# Altium project MAIN_BOARD.PrjPcb (part 3 of 3)

## Sheet NVME.SchDoc
size B; SheetNumber: 9; SheetTotal: 10
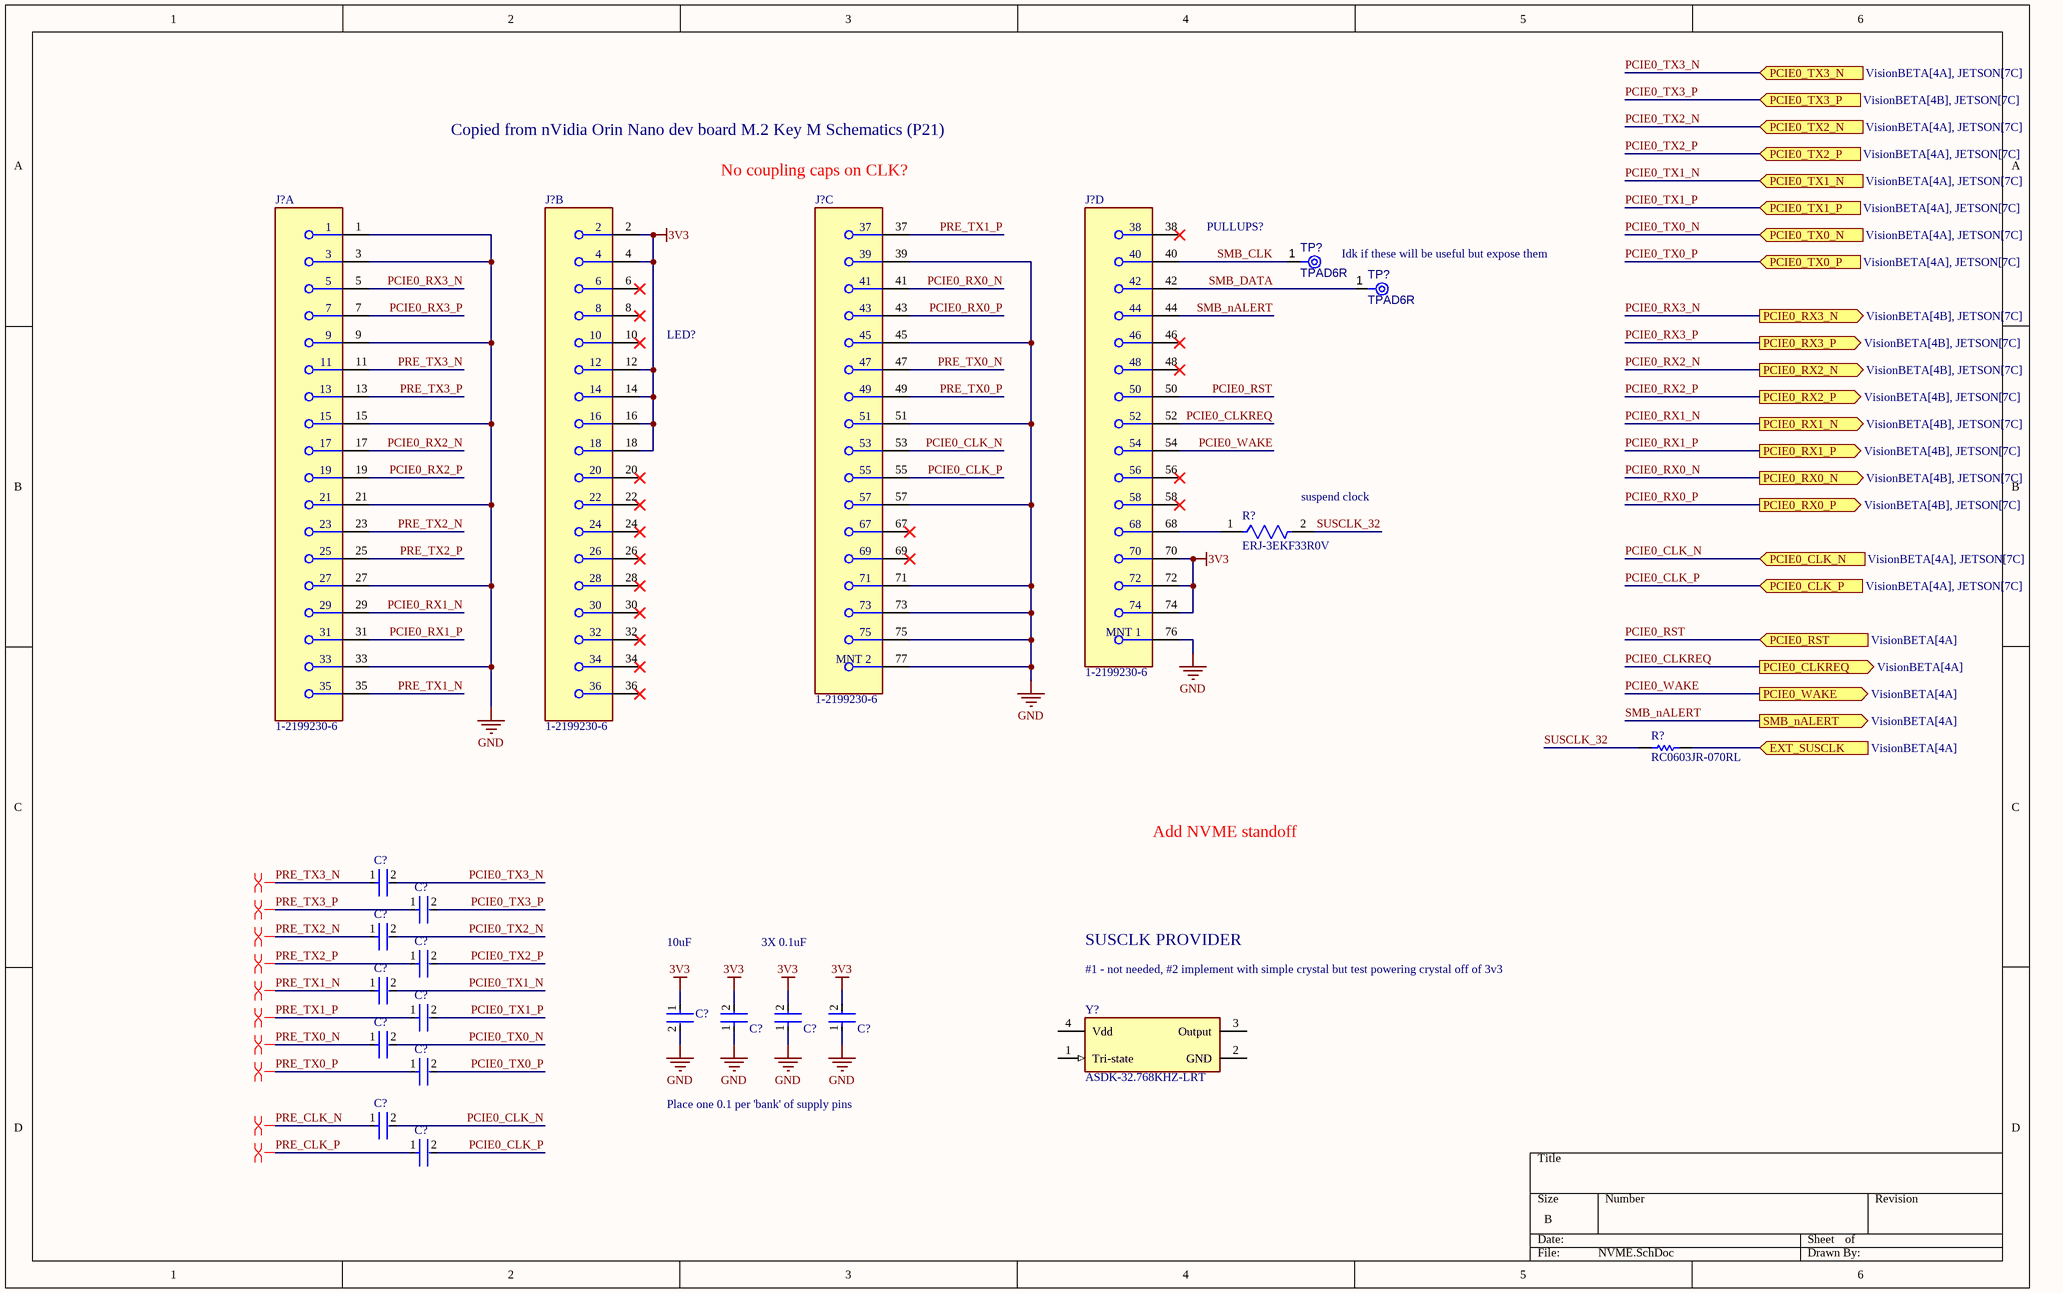
[diagram p12: NVME.SchDoc]

### Parts
(Parts that share a designator on the sheet are numbered #1, #2 ... from top to bottom, then left to right.)
C?#27  C1005X7R1A224K050BB  [FP-C1005-050-0_05-IPC_C]  (value not drawn)
C?#28  C1005X7R1A224K050BB  [FP-C1005-050-0_05-IPC_C]  (value not drawn)
C?#29  C1005X7R1A224K050BB  [FP-C1005-050-0_05-IPC_C]  (value not drawn)
C?#30  C1005X7R1A224K050BB  [FP-C1005-050-0_05-IPC_C]  (value not drawn)
C?#31  C1005X7R1A224K050BB  [FP-C1005-050-0_05-IPC_C]  (value not drawn)
C?#32  GRM188R60J106ME47D  [FP-GRM188-0_1-e0_2_0_55-IPC_A]  (value not drawn)
C?#33  C1005X7R1A224K050BB  [FP-C1005-050-0_05-IPC_C]  (value not drawn)
C?#34  C1005X7R1H104K050BB  [FP-C1005-050-0_05-IPC_C]  (value not drawn)
C?#35  C1005X7R1H104K050BB  [FP-C1005-050-0_05-IPC_C]  (value not drawn)
C?#36  C1005X7R1H104K050BB  [FP-C1005-050-0_05-IPC_C]  (value not drawn)
C?#37  C1005X7R1A224K050BB  [FP-C1005-050-0_05-IPC_C]  (value not drawn)
C?#38  C1005X7R1A224K050BB  [FP-C1005-050-0_05-IPC_C]  (value not drawn)
C?#39  C1005X7R1A224K050BB  [FP-C1005-050-0_05-IPC_C]  (value not drawn)
C?#40  C1005X7R1A224K050BB  [FP-C1005-050-0_05-IPC_C]  (value not drawn)
J?#11  1-2199230-6  [FP-1-2199230-6-MFG]  (part A of 4)
J?#12  1-2199230-6  [FP-1-2199230-6-MFG]  (part B of 4)
J?#13  1-2199230-6  [FP-1-2199230-6-MFG]  (part C of 4)
J?#14  1-2199230-6  [FP-1-2199230-6-MFG]  (part D of 4)
R?#39  ERJ-3EKF33R0V  [FP-ERJ3EK-MFG]
R?#40  RC0603JR-070RL  [RESC1608X55X25ML10T15]
TP?#1  TPAD6R  [TP06R]  (no BOM)
TP?#2  TPAD6R  [TP06R]  (no BOM)
Y?  ASDK-32.768KHZ-LRT  [FP-ASDK-MFG]

### Ports
EXT_SUSCLK (in, see VisionBETA[4A]), PCIE0_CLK_N (in, see VisionBETA[4A], JETSON[7C]), PCIE0_CLK_P (in, see VisionBETA[4A], JETSON[7C]), PCIE0_CLKREQ (out, see VisionBETA[4A]), PCIE0_RST (in, see VisionBETA[4A]), PCIE0_RX0_N (out, see VisionBETA[4B], JETSON[7C]), PCIE0_RX0_P (out, see VisionBETA[4B], JETSON[7C]), PCIE0_RX1_N (out, see VisionBETA[4B], JETSON[7C]), PCIE0_RX1_P (out, see VisionBETA[4B], JETSON[7C]), PCIE0_RX2_N (out, see VisionBETA[4B], JETSON[7C]), PCIE0_RX2_P (out, see VisionBETA[4B], JETSON[7C]), PCIE0_RX3_N (out, see VisionBETA[4B], JETSON[7C]), PCIE0_RX3_P (out, see VisionBETA[4B], JETSON[7C]), PCIE0_TX0_N (in, see VisionBETA[4A], JETSON[7C]), PCIE0_TX0_P (in, see VisionBETA[4A], JETSON[7C]), PCIE0_TX1_N (in, see VisionBETA[4A], JETSON[7C]), PCIE0_TX1_P (in, see VisionBETA[4A], JETSON[7C]), PCIE0_TX2_N (in, see VisionBETA[4A], JETSON[7C]), PCIE0_TX2_P (in, see VisionBETA[4A], JETSON[7C]), PCIE0_TX3_N (in, see VisionBETA[4A], JETSON[7C]), PCIE0_TX3_P (in, see VisionBETA[4B], JETSON[7C]), PCIE0_WAKE (out, see VisionBETA[4A]), SMB_nALERT (out, see VisionBETA[4A])

### Nets
3V3: C?#32.1 C?#34.2 C?#35.2 C?#36.2 J?#12.2 J?#12.4 J?#12.12 J?#12.14 J?#12.16 J?#12.18 J?#14.70 J?#14.72 J?#14.74
GND: C?#32.2 C?#34.1 C?#35.1 C?#36.1 J?#11.1 J?#11.3 J?#11.9 J?#11.15 J?#11.21 J?#11.27 J?#11.33 J?#13.39 J?#13.45 J?#13.51 J?#13.57 J?#13.71 J?#13.73 J?#13.75 J?#13.77(MNT_2) J?#14.76(MNT_1)
PCIE0_CLK_N: C?#39.2 J?#13.53 ; port PCIE0_CLK_N
PCIE0_CLK_P: C?#40.2 J?#13.55 ; port PCIE0_CLK_P
PCIE0_CLKREQ: J?#14.52 ; port PCIE0_CLKREQ
PCIE0_RST: J?#14.50 ; port PCIE0_RST
PCIE0_RX0_N: J?#13.41 ; port PCIE0_RX0_N
PCIE0_RX0_P: J?#13.43 ; port PCIE0_RX0_P
PCIE0_RX1_N: J?#11.29 ; port PCIE0_RX1_N
PCIE0_RX1_P: J?#11.31 ; port PCIE0_RX1_P
PCIE0_RX2_N: J?#11.17 ; port PCIE0_RX2_N
PCIE0_RX2_P: J?#11.19 ; port PCIE0_RX2_P
PCIE0_RX3_N: J?#11.5 ; port PCIE0_RX3_N
PCIE0_RX3_P: J?#11.7 ; port PCIE0_RX3_P
PCIE0_TX0_N: C?#37.2 ; port PCIE0_TX0_N
PCIE0_TX0_P: C?#38.2 ; port PCIE0_TX0_P
PCIE0_TX1_N: C?#31.2 ; port PCIE0_TX1_N
PCIE0_TX1_P: C?#33.2 ; port PCIE0_TX1_P
PCIE0_TX2_N: C?#29.2 ; port PCIE0_TX2_N
PCIE0_TX2_P: C?#30.2 ; port PCIE0_TX2_P
PCIE0_TX3_N: C?#27.2 ; port PCIE0_TX3_N
PCIE0_TX3_P: C?#28.2 ; port PCIE0_TX3_P
PCIE0_WAKE: J?#14.54 ; port PCIE0_WAKE
PRE_CLK_N: C?#39.1
PRE_CLK_P: C?#40.1
PRE_TX0_N: C?#37.1 J?#13.47
PRE_TX0_P: C?#38.1 J?#13.49
PRE_TX1_N: C?#31.1 J?#11.35
PRE_TX1_P: C?#33.1 J?#13.37
PRE_TX2_N: C?#29.1 J?#11.23
PRE_TX2_P: C?#30.1 J?#11.25
PRE_TX3_N: C?#27.1 J?#11.11
PRE_TX3_P: C?#28.1 J?#11.13
SMB_CLK: J?#14.40 TP?#1.1(TP)
SMB_DATA: J?#14.42 TP?#2.1(TP)
SMB_nALERT: J?#14.44 ; port SMB_nALERT
SUSCLK_32: R?#39.2 R?#40.1
NetJ?#14_68: J?#14.68 R?#39.1
NetR?#40_2: R?#40.2 ; port EXT_SUSCLK

Not connected (* = marked no-connect by the designer): J?#12 6* 8* 10* 20* 22* 24* 26* 28* 30* 32* 34* 36*; J?#13 67* 69*; J?#14 38* 46* 48* 56* 58*; Y? 1(Tri-state) 2(GND) 3(Output) 4(Vdd)

### Layout directives
differential pair: PRE_CLK_N, PRE_CLK_P, PRE_TX0_N, PRE_TX0_P, PRE_TX1_N, PRE_TX1_P, PRE_TX2_N, PRE_TX2_P, PRE_TX3_N, PRE_TX3_P

### Notes on the sheet
- Copied from nVidia Orin Nano dev board M.2 Key M Schematics (P21)
- No coupling caps on CLK?
- PULLUPS?
- (near TP?#2) Idk if these will be useful but expose them
- LED?
- (near R?#39) suspend clock
- Add NVME standoff
- 10uF
- 3X 0.1uF
- SUSCLK PROVIDER
- #1 - not needed, #2 implement with simple crystal but test powering crystal off of 3v3
- Place one 0.1 per 'bank' of supply pins

### Library data of the parts
C?#27-C?#31 C?#33 C?#37-C?#40 = CMP-08246-006072-1: Multilayer Ceramic Capacitors 220nF ±10% 10V X7R SMD 0402; Resistor Type: Ceramic; Dielectric: X7R; Voltage Rating (DC): 10V; Width: 0.02inch; Case Code (Metric): 1005; Mount: Surface Mount; Termination: SMD/SMT; Series: C; Tolerance: 10%; Depth: 0.5mm; Length: 1mm; Packaging: Tape and Reel; Radiation Hardening: No; Weight: 2.3E-05oz; Voltage Rating: 10V; Thickness: 0.022inch; Capacitance: 220nF; Case Code (Imperial): 0402; Lead Free: Lead Free; Case/Package: 0402; Package Quantity: 10000; Dielectric Material: Ceramic; RoHS Compliant: Yes; REACH SVHC: No SVHC; Min Operating Temperature: -55°C; Max Operating Temperature: 125°C; Height: 0.5mm; Construction: Flat
C?#32 = CMP-2006-02792-2: Chip Multilayer Ceramic Capacitors for General Purpose, 0603, 10uF, X5R, 15%, 20%, 6.3V; Packaging: Tape and Reel; Voltage Rating (DC): 6.3V; Width: 0.031inch; Termination: SMD/SMT; Dielectric: X5R; Package Quantity: 4000; Voltage Rating: 6.3V; Capacitance: 10uF; Case/Package: 0603; Min Operating Temperature: -55°C; Voltage: 6.3V; Length: 1.6mm; Thickness: 0.035inch; Lead Free: Lead Free; Depth: 0.8mm; Case Code (Imperial): 0603; Max Operating Temperature: 85°C; Material: Ceramic; Height: 0.8mm; Tolerance: 20%; Mount: Surface Mount; REACH SVHC: No SVHC; Radiation Hardening: No; Case Code (Metric): 1608
C?#34-C?#36 = CMP-2000-05393-2: Multilayer Ceramic Capacitors 100nF ±10% 50V X7R SMD 0402; Voltage: 50V; Dielectric Material: Ceramic; Min Operating Temperature: -55°C; Depth: 0.5mm; Radiation Hardening: No; RoHS Compliant: Yes; Voltage Rating (DC): 50V; Lead Free: Lead Free; Resistor Type: Ceramic; Height: 0.5mm; Dielectric: X7R; Thickness: 0.022inch; Case/Package: 0402; Case Code (Metric): 1005; Termination: SMD/SMT; Capacitance: 100nF; Packaging: Tape and Reel; Max Operating Temperature: 125°C; Mount: Surface Mount; Package Quantity: 1; Width: 0.02inch; Weight: 2.3E-05oz; Voltage Rating: 50V; Tolerance: 10%; Construction: Flat; Case Code (Imperial): 0402; Length: 1mm; REACH SVHC: No SVHC; Series: C
J?#11-J?#14 = CMP-03365-000001-1: CONN EDGE DUAL FMALE 67POS 0.020; Manufacturer: TE; Number Of Contacts: 67; Current Rating: 0.5A; Pitch: 0.5mm; Conn Gender: Female; Is Female: yes; Voltage Rating: 50V; Conn Orientation: Right Angle; Automotive: No; Temperature Range High: +80°C; Package: 1-2199230-6; Category: Conn; Temperature: -40°C to +80°C; Number Of Rows: 2; ComponentLink2URL: http://www.te.com/commerce/DocumentDelivery/DDEController?Action=showdoc&DocId=Specification+Or+Standard%7F114-115006%7FB%7Fpdf%7FEnglish%7FENG_SS_114-115006_B_114-115006_REV_B.pdf%7F1-2199230-6; Manufacturer Part Number: 1-2199230-6; Height: 4.2mm; RoHS: TRUE; Footprint Url: http://www.te.com/commerce/DocumentDelivery/DDEController?Action=showdoc&DocId=Customer+Drawing%7F2199230%7FB2%7Fpdf%7FEnglish%7FENG_CD_2199230_B2.pdf%7F1-2199230-6; Digikey Description: CONN EDGE DUAL FMALE 67POS 0.020; Device Class L2: Card Edge Connectors; Contact Material: Gold,Tin; Device Class L1: Connectors; Device Class L3: unset; ComponentLink2Description: Datasheet; Temperature Range Low: -40°C; Octopart: https://octopart.com/1-2199230-6-te+connectivity-34969376; Lead Free: Yes
R?#39 = CMP-2000-00443-2: RES SMD 33 OHM 1% 1/10W 0603; Voltage Rating (DC): 75V; Power Rating: 100mW; Resistance: 33R; Temperature Coefficient: 100ppm/°C; Min Operating Temperature: -55°C; Packaging: Tape and Reel; Mount: Surface Mount; Lead Free: Lead Free; Voltage Rating: 75V; Features: Automotive AEC-Q200; Height: 0.022inch; Width: 0.031inch; Number of Pins: 2; Package Quantity: 1; Case Code (Metric): 1608; Max Power Dissipation: 100mW; Case Code (Imperial): 0603; Termination: SMD/SMT; Resistance Tolerance: 1%; Max Operating Temperature: 155°C; Tolerance: 1%; Length: 1.6mm; Case/Package: 0603; Military Standard: Not; RoHS Compliant: Yes; Series: ERJ; Size Code: 0603; Construction: Rectangular; Number of Terminations: 2; Radiation Hardening: No; Resistor Type: Thick Film; Contact Plating: Tin; Depth: 0.8mm; REACH SVHC: No SVHC
R?#40 = CMP-2100-03667-1: Chip Resistor, 0 Ohm, +/- 5%, 0.1 W, -55 to 155 degC, 0603 (1608 Metric), RoHS, Tape and Reel; Manufacturer: Yageo; Temperature Coefficient: 200ppm/degreesC; Voltage Rating: 50V; Power Rating: 100mW; Resistance: 0mOhm; Width: 0.8mm; Max Operating Temperature: 155degC; Tolerance: 5%; Package Reference: 0603; Height: 0.45mm; Depth: 0.8mm; Package Description: 2-Pin Surface Mount Device, Body 1.6 x 0.8 mm; Termination: SMD/SMT; Package Quantity: 5000; Case/Package: 0603; Case Code (Imperial): 0603; Radiation Hardening: No; Number of Pins: 2; Length: 1.6mm; Lead Free: LeadFree; Voltage Rating (DC): 50V; Military Standard: Not; Datasheet URL: http://www.yageo.com/NewPortal/yageodocoutput?fileName=/pdf/R-Chip/PYu-RC_Group_51_RoHS_L_5.pdf; Manufacturer URL: http://www.yageo.com/; Packaging: TapeandReel; Case Code (Metric): 1608; Min Operating Temperature: -55degC; Composition: ThickFilm; RoHSCompliant: true; Contact Plating: Tin; Datasheet Version: Rev. 5, 10/2016; REACH SVHC: NoSVHC
TP?#1 TP?#2 = CMP-00028-00002-2: 0.6mm round; Pins: 1
Y? = CMP-27762-001115-1: XTAL OSC XO 32.7680KHZ CMOS SMD; Load Capacitance: 15pF; Max Supply Current: 3.5mA; Min Supply Voltage: 2.97V; Operating Supply Voltage: 3.3V; Frequency Stability: 25ppm; Lead Free: Lead Free; Case/Package: CSMD; Number of Pins: 4; Max Operating Temperature: 85°C; Packaging: Tape and Reel; Width: 0.079inch; Min Operating Temperature: -40°C; Radiation Hardening: No; Length: 2.5mm; Depth: 2mm; Termination: SMD/SMT; Height: 0.037inch; Series: ASDK; Frequency: 32.768kHz; Mount: Surface Mount

## Sheet RECOVERY_USBC.SchDoc
size A4; SheetNumber: 8; SheetTotal: 8
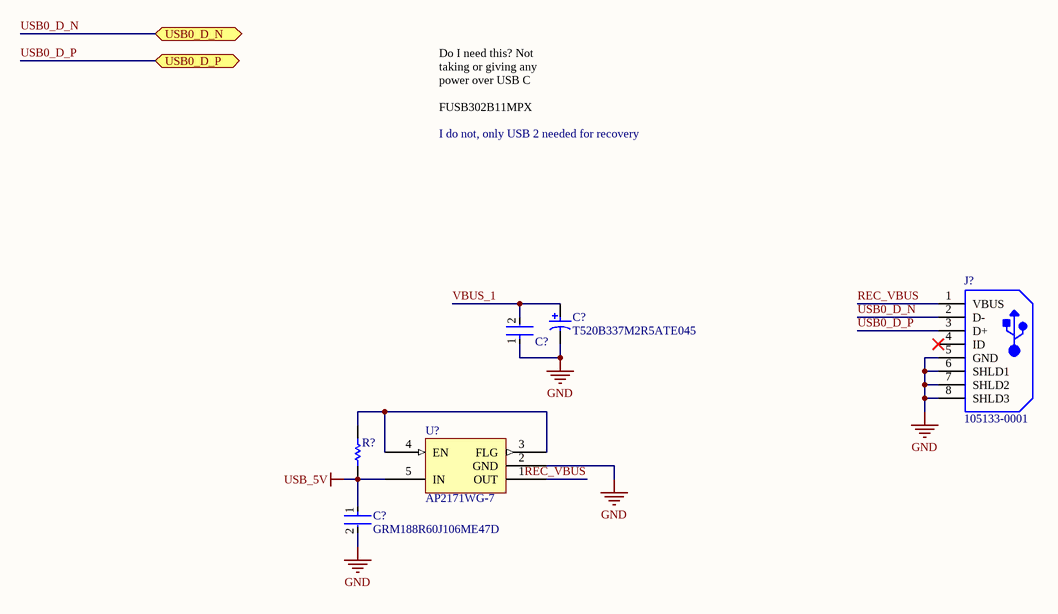
[diagram p13: RECOVERY_USBC.SchDoc]

### Parts
(Parts that share a designator on the sheet are numbered #1, #2 ... from top to bottom, then left to right.)
C?#41  T520B337M2R5ATE045  [KEMT-520-B-2_M]
C?#42  C1005X7R1H104K050BB  [FP-C1005-050-0_05-IPC_C]  (value not drawn)
C?#43  GRM188R60J106ME47D  [FP-GRM188-0_1-e0_2_0_55-IPC_A]
J?#15  105133-0001  [MOLX-105133-0001_V]
R?#41  ERJ3EKF1002V  [RESC1609X55X30LL15T15]  (value not drawn)
U?#4  AP2171WG-7  [SOT95P285X130-5N]

### Ports
USB0_D_N (bidir), USB0_D_P (bidir)

### Nets
GND: C?#41.2 C?#42.1 C?#43.2 J?#15.5(GND) J?#15.6(SHLD1) J?#15.7(SHLD2) J?#15.8(SHLD3) U?#4.2(GND)
USB_5V: C?#43.1 R?#41.1 U?#4.5(IN)
REC_VBUS: J?#15.1(VBUS) U?#4.1(OUT)
USB0_D_N: J?#15.2(D-) ; port USB0_D_N
USB0_D_P: J?#15.3(D+) ; port USB0_D_P
VBUS_1: C?#41.1 C?#42.2
NetR?#41_2: R?#41.2 U?#4.3(FLG) U?#4.4(EN)

Not connected (* = marked no-connect by the designer): J?#15 4(ID)*

### Notes on the sheet
- Do I need this? Not taking or giving any power over USB C
  FUSB302B11MPX
- I do not, only USB 2 needed for recovery

### Library data of the parts
C?#41 = CMP-1664-00002-2: Tantalum Capacitor, 330 uF, +/- 20%, 2.5 V, -55 to 105 degC, 2-Pin Molded, RoHS, Tape and Reel; Capacitance: 330 uF; PartNumber: T520B337M2R5ATE045; DatasheetVersion: 07/2016; Radiation Hardening: No; ComponentLink2Description: Datasheet; PackageDescription: 2-Pin Surface Mount Device, Body 3.5 x 2.8 mm; Width: 2.8 mm; ComponentLink2URL: http://capacitoredge.kemet.com/capedge2/DataSheet?pn=T520B337M2R5ATE045; Case/Package: 1411; Length: 3.5 mm; Package Quantity: 2000; Max Operating Temperature: 105 degC; Mounting Technology: Surface Mount; Height: 2.1 mm; RoHSCompliant: True; ComponentLink1URL: http://www.kemet.com/; Mount: Surface Mount; Packaging: Tape and Reel; ComponentLink1Description: Manufacturer URL; Min Operating Temperature: -55 degC
C?#42 = CMP-2000-05393-2: as C?#34 on sheet NVME; Voltage: 50V; Dielectric Material: Ceramic; Min Operating Temperature: -55°C; Depth: 0.5mm; Radiation Hardening: No; RoHS Compliant: Yes; Voltage Rating (DC): 50V; Lead Free: Lead Free; Resistor Type: Ceramic; Height: 0.5mm; Dielectric: X7R; Thickness: 0.022inch; Case/Package: 0402; Case Code (Metric): 1005; Termination: SMD/SMT; Capacitance: 100nF; Packaging: Tape and Reel; Max Operating Temperature: 125°C; Mount: Surface Mount; Package Quantity: 1; Width: 0.02inch; Weight: 2.3E-05oz; Voltage Rating: 50V; Tolerance: 10%; Construction: Flat; Case Code (Imperial): 0402; Length: 1mm; REACH SVHC: No SVHC; Series: C
C?#43 = CMP-2006-02792-2: as C?#32 on sheet NVME; Packaging: Tape and Reel; Voltage Rating (DC): 6.3V; Width: 0.031inch; Termination: SMD/SMT; Dielectric: X5R; Package Quantity: 4000; Voltage Rating: 6.3V; Capacitance: 10uF; Case/Package: 0603; Min Operating Temperature: -55°C; Voltage: 6.3V; Length: 1.6mm; Thickness: 0.035inch; Lead Free: Lead Free; Depth: 0.8mm; Case Code (Imperial): 0603; Max Operating Temperature: 85°C; Material: Ceramic; Height: 0.8mm; Tolerance: 20%; Mount: Surface Mount; REACH SVHC: No SVHC; Radiation Hardening: No; Case Code (Metric): 1608
J?#15 = CMP-2000-05829-1: Micro-USB B Receptacle, Vertical, -30 to 85 degC, 5-Pin SMD, RoHS, Tape and Reel; Manufacturer: Molex; Package Version: Rev. C, 11/2015; Voltage Rating: 30VAC; Connector Type: MicroUSBTypeBReceptacle; Current Rating: 1.8A; Number of Ports: 1; Voltage - Max: 30V; Mounting Style: SMD/SMT; Packaging: Reel; Product: MicroUSBTypeBConnectors; Contact Plating: Gold; Flammability Rating: UL94V-0; Package Description: 5-Pin Surface Mount Device, Pitch 0.65 mm; Package Reference: 105133-0001; Contact Material: CopperAlloy; Mounting Angle: Vertical; RoHS: Details; Manufacturer URL: http://www.molex.com/; Factory Pack Quantity: 6000; PartNumber: 105133-0001; Standard: USB; Brand: Molex; Series: 105133; Product Category: USBConnectors; Termination Style: SolderTail; Gender: Receptacle; Package URL: http://www.molex.com/pdm_docs/sd/1051330001_sd.pdf; Datasheet Version: 03/2016; Color: Black; Datasheet URL: http://www.molex.com/webdocs/datasheets/pdf/en-us/1051330001_IO_CONNECTORS.pdf; Mounting Technology: SurfaceMount
R?#41 = CMP-1012-00623-3: Chip Resistor, 10 KOhm, +/- 1%, 0.1 W, -55 to 155 degC, 0603 (1608 Metric), RoHS, Tape and Reel; Manufacturer: Panasonic; Voltage Rating: 75V; Case\/Package: 0603; Power Rating: 100mW; Resistance: 10KOhm; Temperature Coefficient: 100ppm\/degreesC; Number of Pins: 2; Package Reference: 603; Depth: 0.8mm; Mount: SurfaceMount; Package Description: 2-Pin Surface Mount Device, Body 1.6 x 0.85 mm; Datasheet Version: 02/2017; Length: 1.6mm; Lead Free: LeadFree; Height: 0.45mm; Number of Terminations: 2; Max Power Dissipation: 100mW; Min Operating Temperature: -55degC; Datasheet URL: https://industrial.panasonic.com/cdbs/www-data/pdf/RDA0000/AOA0000C304.pdf; Termination: SMD/SMT; Case Code (Metric): 1608; Case Code (Imperial): 0603; Tolerance: 1%; Max Operating Temperature: 155degC; RoHSCompliant: true; Voltage Rating (DC): 75V; Radiation Hardening: No; Packaging: TapeandReel; Composition: ThickFilm; Mounting Technology: SurfaceMount; Manufacturer URL: http://www.panasonic.com/; Width: 0.031inch; REACH SVHC: NoSVHC; Contact Plating: Tin; Military Standard: Not; Package Quantity: 1
U?#4 = CMP-019-00057-1: IC PWR SW USB 1CH 1A SOT-25-5

## Nets that join several sheets
1V2: CAMIF_0 (9 pins), CAMIF_1 (9 pins)
1V8: CAMIF_0 (6 pins), CAMIF_1 (6 pins)
3V3: CAMIF_0 (12 pins), USB0 (20 pins), ETHERNET (R?#3.1 R?#4.1), NVME (13 pins), CAMIF_1 (12 pins), USB1 (20 pins)
GND: CAMIF_0 (64 pins), JETSON (68 pins), USB0 (50 pins), ETHERNET (C?#1.2), REGULATORS (15 pins), HDMI (29 pins), NVME (20 pins), CAMIF_1 (64 pins), RECOVERY_USBC (8 pins), USB1 (50 pins)
USB_5V: USB0 (6 pins), RECOVERY_USBC (C?#43.1 R?#41.1 U?#4.5), USB1 (6 pins)
PCIE0_CLK_N: JETSON (J?#4.160), NVME (C?#39.2 J?#13.53)
PCIE0_CLK_P: JETSON (J?#6.162), NVME (C?#40.2 J?#13.55)
PCIE0_RX0_N: JETSON (J?#3.131), NVME (J?#13.41)
PCIE0_RX0_P: JETSON (J?#3.133), NVME (J?#13.43)
PCIE0_RX1_N: JETSON (J?#3.137), NVME (J?#11.29)
PCIE0_RX1_P: JETSON (J?#3.139), NVME (J?#11.31)
PCIE0_RX2_N: JETSON (J?#3.149), NVME (J?#11.17)
PCIE0_RX2_P: JETSON (J?#3.151), NVME (J?#11.19)
PCIE0_RX3_N: JETSON (J?#3.155), NVME (J?#11.5)
PCIE0_RX3_P: JETSON (J?#3.157), NVME (J?#11.7)
PCIE0_TX0_N: JETSON (J?#4.134), NVME (C?#37.2)
PCIE0_TX0_P: JETSON (J?#4.136), NVME (C?#38.2)
PCIE0_TX1_N: JETSON (J?#4.140), NVME (C?#31.2)
PCIE0_TX1_P: JETSON (J?#4.142), NVME (C?#33.2)
PCIE0_TX2_N: JETSON (J?#4.148), NVME (C?#29.2)
PCIE0_TX2_P: JETSON (J?#4.150), NVME (C?#30.2)
PCIE0_TX3_N: JETSON (J?#4.154), NVME (C?#27.2)
PCIE0_TX3_P: JETSON (J?#4.156), NVME (C?#28.2)